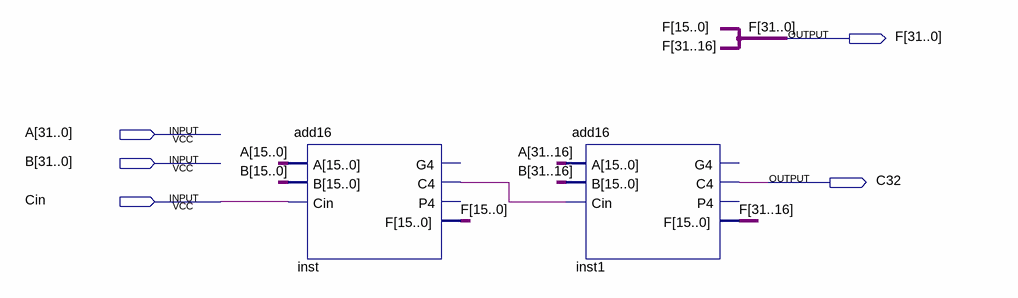
[diagram p0: schematic sheet]
// Quartus schematic add32.bdf as structural Verilog: 2 symbols, 5 pins
module add32 (
  input  [31:0] A,
  input  [31:0] B,
  input  Cin,
  output [31:0] F,
  output C32
);

  wire inst_c4;

  add16 inst (.A(A[15:0]), .B(B[15:0]), .Cin(Cin), .C4(inst_c4), .F(F[15:0]));  // open: G4, P4
  add16 inst1 (.A(A[31:16]), .B(B[31:16]), .Cin(inst_c4), .C4(C32), .F(F[31:16]));  // open: G4, P4
endmodule
